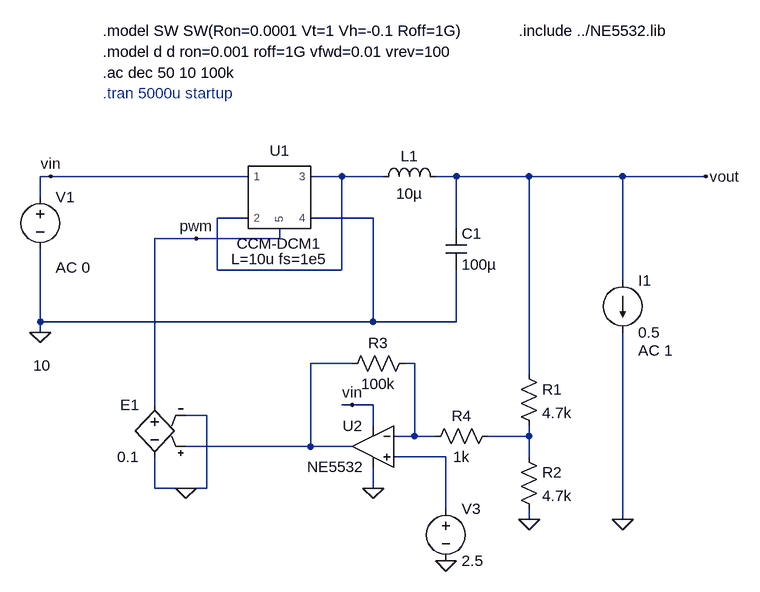
[diagram p0: schematic avg-ac-fb.asc]
avg-ac-fb.asc, the LTspice schematic file:
Version 4
SHEET 1 1492 724
WIRE -128 112 -144 112
WIRE 176 112 -128 112
WIRE 320 112 272 112
WIRE 384 112 320 112
WIRE 496 112 464 112
WIRE 608 112 496 112
WIRE 752 112 608 112
WIRE 880 112 752 112
WIRE -144 144 -144 112
WIRE 176 176 128 176
WIRE 368 176 272 176
WIRE 496 192 496 112
WIRE 96 208 32 208
WIRE 224 208 224 192
WIRE 224 208 96 208
WIRE 128 256 128 176
WIRE 320 256 320 112
WIRE 320 256 128 256
WIRE 752 272 752 112
WIRE -144 336 -144 224
WIRE 368 336 368 176
WIRE 368 336 -144 336
WIRE 496 336 496 256
WIRE 496 336 368 336
WIRE -144 352 -144 336
WIRE 336 400 272 400
WIRE 432 400 416 400
WIRE 608 416 608 112
WIRE 32 464 32 208
WIRE 336 464 320 464
WIRE 368 464 336 464
WIRE 112 480 80 480
WIRE 368 496 368 464
WIRE 432 512 432 400
WIRE 432 512 400 512
WIRE 464 512 432 512
WIRE 608 512 608 496
WIRE 608 512 544 512
WIRE 272 528 272 400
WIRE 272 528 80 528
WIRE 336 528 272 528
WIRE 480 544 400 544
WIRE 608 544 608 512
WIRE 32 592 32 544
WIRE 80 592 32 592
WIRE 112 592 112 480
WIRE 112 592 80 592
WIRE 368 592 368 560
WIRE 480 624 480 544
WIRE 608 640 608 624
WIRE 752 640 752 352
FLAG -144 352 0
FLAG 880 112 vout
FLAG -128 112 vin
FLAG 96 208 pwm
FLAG 608 640 0
FLAG 480 704 0
FLAG 368 592 0
FLAG 80 592 0
FLAG 752 640 0
FLAG 336 464 vin
SYMBOL voltage -144 128 R0
WINDOW 123 24 124 Left 2
WINDOW 39 0 0 Left 0
WINDOW 3 -11 275 Left 2
SYMATTR Value2 AC 0
SYMATTR Value 10
SYMATTR InstName V1
SYMBOL ind 368 128 R270
WINDOW 0 32 56 VTop 2
WINDOW 3 5 56 VBottom 2
SYMATTR InstName L1
SYMATTR Value 10µ
SYMBOL cap 480 192 R0
SYMATTR InstName C1
SYMATTR Value 100µ
SYMBOL AutoGenerated\\CCM-DCM1 224 144 R0
SYMATTR InstName U1
SYMATTR SpiceLine L=10u fs=1e5
SYMBOL res 592 400 R0
SYMATTR InstName R1
SYMATTR Value 4.7k
SYMBOL res 592 528 R0
SYMATTR InstName R2
SYMATTR Value 4.7k
SYMBOL voltage 480 608 R0
WINDOW 123 0 0 Left 0
WINDOW 39 0 0 Left 0
SYMATTR InstName V3
SYMATTR Value 2.5
SYMBOL e2 32 448 M0
SYMATTR InstName E1
SYMATTR Value 0.1
SYMBOL current 752 272 R0
WINDOW 123 24 108 Left 2
WINDOW 39 0 0 Left 0
SYMATTR Value2 AC 1
SYMATTR InstName I1
SYMATTR Value 0.5
SYMBOL res 432 384 R90
WINDOW 0 0 56 VBottom 2
WINDOW 3 32 56 VTop 2
SYMATTR InstName R3
SYMATTR Value 100k
SYMBOL res 560 496 R90
WINDOW 0 0 56 VBottom 2
WINDOW 3 32 56 VTop 2
SYMATTR InstName R4
SYMATTR Value 1k
SYMBOL OpAmps\\opamp2 368 464 M0
WINDOW 3 14 95 Left 2
SYMATTR InstName U2
SYMATTR Value NE5532
TEXT -48 -112 Left 2 !.model SW SW(Ron=0.0001 Vt=1 Vh=-0.1 Roff=1G)
TEXT -48 -80 Left 2 !.model d d ron=0.001 roff=1G vfwd=0.01 vrev=100
TEXT -48 -48 Left 2 !.ac dec 50 10 100k
TEXT -48 -16 Left 2 ;.tran 5000u startup
TEXT 592 -112 Left 2 !.include ../NE5532.lib

The netlist it stands for:
* avg-ac-fb.asc
V1 vin 0 10 AC 0
L1 N001 vout 10µ
C1 vout 0 100µ
XU1 vin N001 N001 0 pwm CCM-DCM1 L=10u fs=1e5  ; pins 1 2 3 4 5
R1 vout N004 4.7k
R2 N004 0 4.7k
V3 N005 0 2.5
E1 pwm 0 N002 0 0.1
I1 vout 0 0.5 AC 1
R3 N003 N002 100k
R4 N004 N003 1k
XU2 N005 N003 vin 0 N002 NE5532  ; pins In+ In- V+ V- OUT
.model SW SW(Ron=0.0001 Vt=1 Vh=-0.1 Roff=1G)
.model d d ron=0.001 roff=1G vfwd=0.01 vrev=100
.ac dec 50 10 100k
* .tran 5000u startup
.include ../NE5532.lib
.lib CCM-DCM1.mod
.backanno
.end